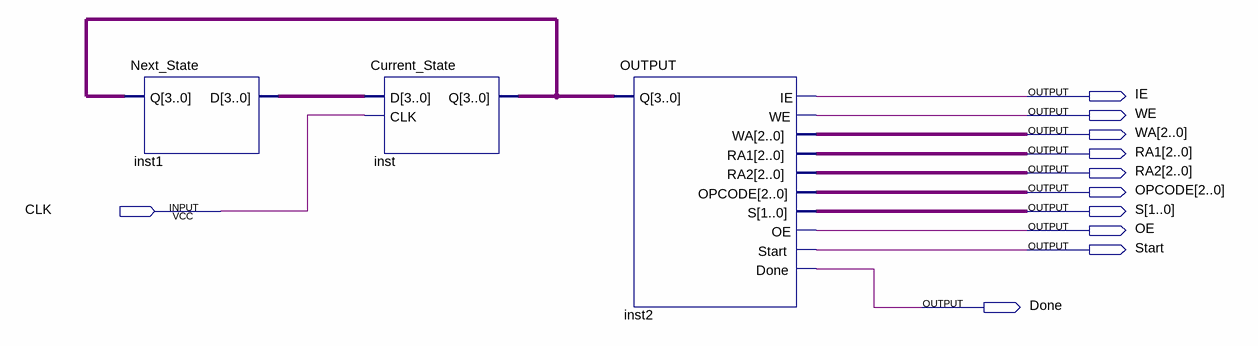
[diagram p0: schematic sheet]
// Quartus schematic CONTROLL_UNIT.bdf as structural Verilog: 3 symbols, 11 pins
module CONTROLL_UNIT (
  input  CLK,
  output IE,
  output WE,
  output [2:0] WA,
  output [2:0] RA1,
  output [2:0] RA2,
  output [2:0] OPCODE,
  output [1:0] S,
  output OE,
  output Start,
  output Done
);

  wire [3:0] inst1_d, inst_q;

  Next_State inst1 (.Q(inst_q), .D(inst1_d));
  Current_State inst (.D(inst1_d), .CLK(CLK), .Q(inst_q));
  OUTPUT inst2 (
    .Q(inst_q), .IE(IE), .WE(WE), .WA(WA), .RA1(RA1), .RA2(RA2), .OPCODE(OPCODE), .S(S), .OE(OE),
    .Start(Start), .Done(Done));
endmodule
